# Altium schematic sheet MCU.SchDoc
size A4; DocumentNumber: 4; SheetNumber: 2; SheetTotal: 6
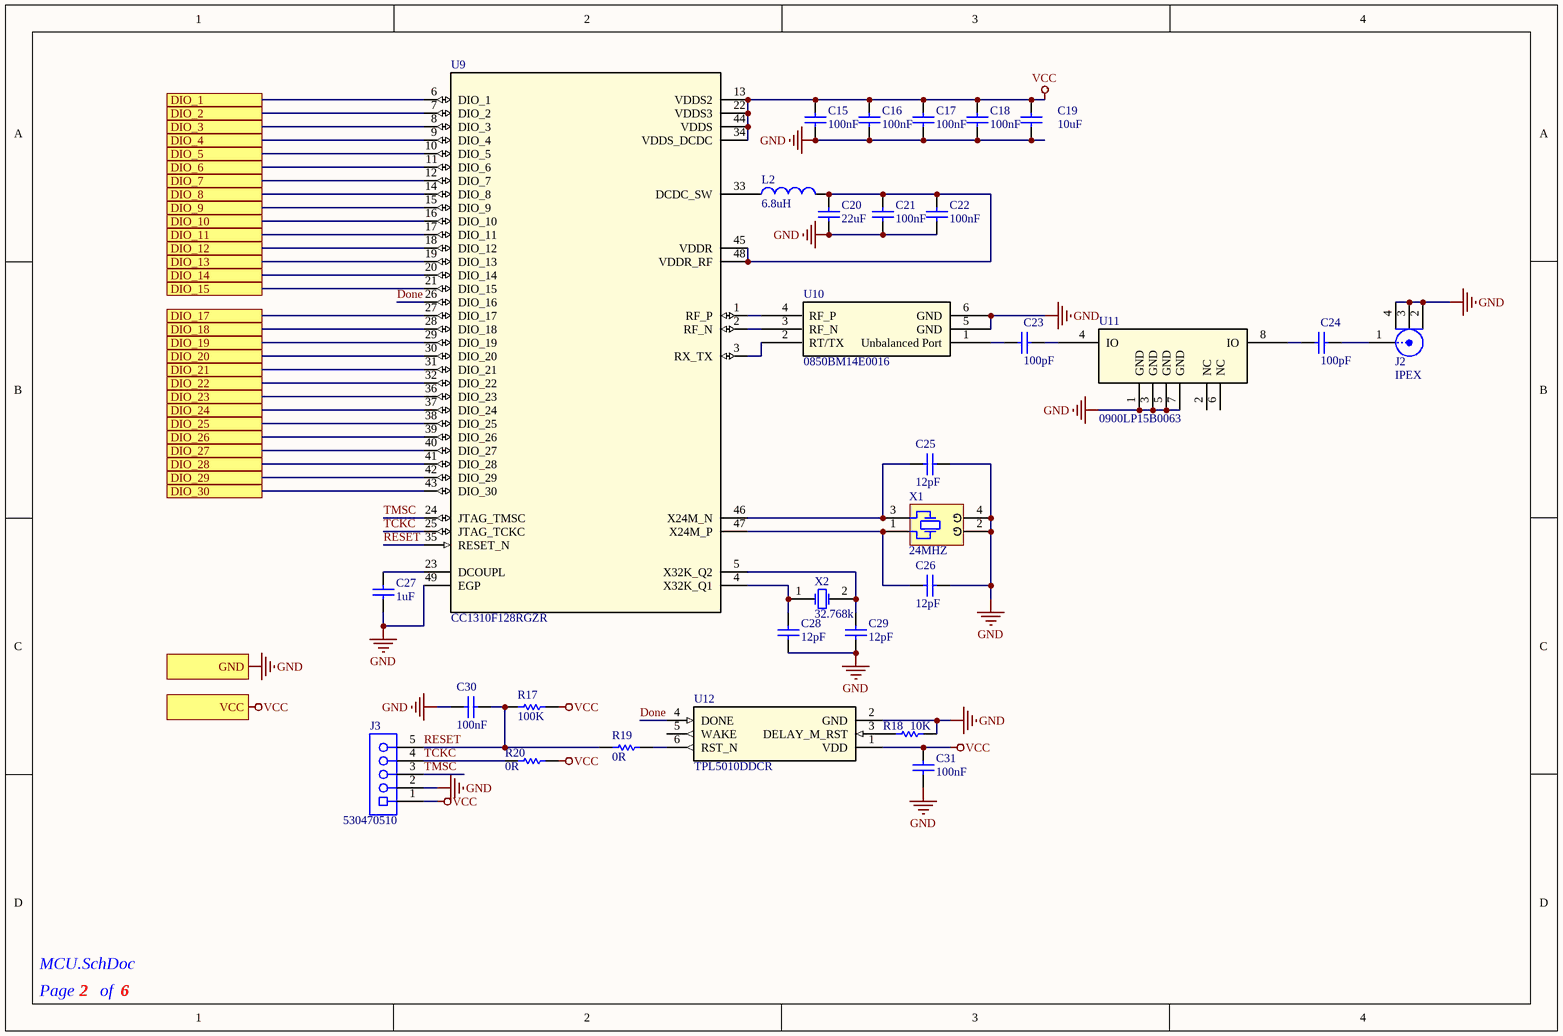
[diagram p0: MCU.SchDoc]

## Parts
C15  100nF  [R0603_C]
C16  100nF  [R0603_C]
C17  100nF  [R0603_C]
C18  100nF  [R0603_C]
C19  10uF  [R0805_C]
C20  22uF  [R0805_C]
C21  100nF  [R0603_C]
C22  100nF  [R0603_C]
C23  100pF  [R0402_C]
C24  100pF  [R0402_C]
C25  12pF  [R0402_C]
C26  12pF  [R0402_C]
C27  1uF  [R0603_C]
C28  12pF  [R0402_C]
C29  12pF  [R0402_C]
C30  100nF  [R0603_C]
C31  100nF  [R0603_C]
J2  IPEX  [molex-73412]
J3  530470510  [1.25mm_p5]
L2  6.8uH  [R0805_L]
R17  100K  [R0603_R]
R18  10K  [R0603_R]
R19  0R  [R0603_R]
R20  0R  [R0603_R]
U9  CC1310F128RGZR  [RGZ0048A]
U10  0850BM14E0016  [6P0603]
U11  0900LP15B0063  [8P0805]
U12  TPL5010DDCR  [DBV0006A_N]
X1  24MHZ  [SMD-3225]
X2  32.768k  [FC-135]

## Ports
DIO_1, DIO_2, DIO_3, DIO_4, DIO_5, DIO_6, DIO_7, DIO_8, DIO_9, DIO_10, DIO_11, DIO_12, DIO_13, DIO_14, DIO_15, DIO_17, DIO_18, DIO_19, DIO_20, DIO_21, DIO_22, DIO_23, DIO_24, DIO_25, DIO_26, DIO_27, DIO_28, DIO_29, DIO_30, GND, VCC

## Nets
GND: C15.1 C16.1 C17.1 C18.1 C19.1 C20.1 C21.1 C22.1 C25.1 C26.1 C27.1 C28.1 C29.1 C30.2 C31.1 J2.2 J2.3 J2.4 J3.2 R18.1 U9.49(EGP) U10.5(GND) U10.6(GND) U11.1(GND) U11.3(GND) U11.5(GND) U11.7(GND) U12.2(GND) X1.2(GND) X1.4(GND) ; port GND
VCC: C15.2 C16.2 C17.2 C18.2 C19.2 C31.2 J3.1 R17.2 R20.1 U9.13(VDDS2) U9.22(VDDS3) U9.34(VDDS_DCDC) U9.44(VDDS) U12.1(VDD) ; port VCC
DIO_1: U9.6(DIO_1) ; port DIO_1
DIO_2: U9.7(DIO_2) ; port DIO_2
DIO_3: U9.8(DIO_3) ; port DIO_3
DIO_4: U9.9(DIO_4) ; port DIO_4
DIO_5: U9.10(DIO_5) ; port DIO_5
DIO_6: U9.11(DIO_6) ; port DIO_6
DIO_7: U9.12(DIO_7) ; port DIO_7
DIO_8: U9.14(DIO_8) ; port DIO_8
DIO_9: U9.15(DIO_9) ; port DIO_9
DIO_10: U9.16(DIO_10) ; port DIO_10
DIO_11: U9.17(DIO_11) ; port DIO_11
DIO_12: U9.18(DIO_12) ; port DIO_12
DIO_13: U9.19(DIO_13) ; port DIO_13
DIO_14: U9.20(DIO_14) ; port DIO_14
DIO_15: U9.21(DIO_15) ; port DIO_15
DIO_17: U9.27(DIO_17) ; port DIO_17
DIO_18: U9.28(DIO_18) ; port DIO_18
DIO_19: U9.29(DIO_19) ; port DIO_19
DIO_20: U9.30(DIO_20) ; port DIO_20
DIO_21: U9.31(DIO_21) ; port DIO_21
DIO_22: U9.32(DIO_22) ; port DIO_22
DIO_23: U9.36(DIO_23) ; port DIO_23
DIO_24: U9.37(DIO_24) ; port DIO_24
DIO_25: U9.38(DIO_25) ; port DIO_25
DIO_26: U9.39(DIO_26) ; port DIO_26
DIO_27: U9.40(DIO_27) ; port DIO_27
DIO_28: U9.41(DIO_28) ; port DIO_28
DIO_29: U9.42(DIO_29) ; port DIO_29
DIO_30: U9.43(DIO_30) ; port DIO_30
Done: U9.26(DIO_16) U12.4(DONE)
RESET: C30.1 J3.5 R17.1 R19.2 U9.35(RESET_N)
TCKC: J3.4 R20.2 U9.25(JTAG_TCKC)
TMSC: J3.3 U9.24(JTAG_TMSC)
NetC20_2: C20.2 C21.2 C22.2 L2.2 U9.45(VDDR) U9.48(VDDR_RF)
NetC23_1: C23.1 U10.1(Unbalanced_Port)
NetC23_2: C23.2 U11.4(IO)
NetC24_1: C24.1 U11.8(IO)
NetC24_2: C24.2 J2.1
NetC25_2: C25.2 U9.46(X24M_N) X1.3
NetC26_2: C26.2 U9.47(X24M_P) X1.1
NetC27_2: C27.2 U9.23(DCOUPL)
NetC28_2: C28.2 U9.4(X32K_Q1) X2.1(OSC1)
NetC29_2: C29.2 U9.5(X32K_Q2) X2.2(OSC2)
NetL2_1: L2.1 U9.33(DCDC_SW)
NetR18_2: R18.2 U12.3(DELAY_M_RST)
NetR19_1: R19.1 U12.6(RST_N)
NetU9_1: U9.1(RF_P) U10.4(RF_P)
NetU9_2: U9.2(RF_N) U10.3(RF_N)
NetU9_3: U9.3(RX_TX) U10.2(RT/TX)

Not connected (* = marked no-connect by the designer): U11 2(NC) 6(NC); U12 5(WAKE)

## Notes on the sheet
- Page
- of
- (in symbol X1E000021012700) G

## Library data of the parts
C15-C18 C21 C22 C30 C31 = 100nF/0603/50V: 精度 ±10% / 容值 100nF / 额定电压 50V / 温漂系数（介质材料) X7R; 厂家: FH(风华); 型号: 0603B104K500NT; 封装: 0603; 类型: Capacitor; 订货编码: C30926
C19 = 10uF/0805/16V: 精度 ±10% / 容值 10uF / 额定电压 16V / 温漂系数（介质材料) X7R; 厂家: FH(风华); 型号: 0805B106K160NT; 封装: 0805; 类型: Capacitor; 订货编码: C92341
C20 = 22uF/0805/16V: 精度 ±20% / 容值 22uF / 额定电压 16V / 温漂系数（介质材料) X5R; 厂家: FH(风华); 型号: 0805X226M160NT; 封装: 0805; 类型: Capacitor; 订货编码: C129302
C23 C24 = 100pF/0402/50V: 精度 ±5% / 容值 100pF / 额定电压 50V / 温漂系数（介质材料) C0G; 厂家: FH(风华); 型号: 0402CG101J500NT; 封装: 0402; 类型: Capacitor; 订货编码: C1546
C25 C26 C28 C29 = 12pF/0402/50V: 精度 ±1% / 容值 12pF / 额定电压 50V / 温漂系数（介质材料) C0G; 厂家: FH(风华); 型号: 0402CG120F500NT; 封装: 0402; 类型: Capacitor; 订货编码: C182477
C27 = 1uF/0603/50V: 精度 ±10% / 容值 1uF / 额定电压 50V / 温漂系数（介质材料) X7R; 厂家: FH(风华); 型号: 0603B105K500NT; 封装: 0603; 类型: Capacitor; 订货编码: C90540
J2 = 73412-0110: RF同轴连接器（天线座）; 厂家: MOLEX; 型号: 734120110; 封装: SMD; 类型: IPEX插座; 订货编码: C434806; System: Connector
J3 = Molex-530470510: MX1.25 直插 镀锡 5P 针座; 厂家: MOLEX; 封装: 1.25mm 5p; 类型: 连接器; 订货编码: C471412; System: Connector; 型号: 530470510
L2 = 6.8uH/0805: 精度 ±10% / 电感值 6.8uH / 直流电阻（内阻） 250mΩ / 额定电流 250mA; 厂家: FH(风华); 型号: CMP201209XD6R8KT; 封装: 0805; 类型: Inductor; 订货编码: C139247
R17 = 100K/0603: 精度 ±1% / 阻值 100kΩ / 温度系数 ±100ppm/℃ / 功率 0.1W; 厂家: FH(风华); 型号: RS-03K1003FT; 类型: Resistor; 订货编码: C115320; 封装: 0603
R18 = 10K/0603: 精度 ±1% / 温度系数 ±100ppm/℃ / 阻值 10kΩ / 功率 0.1W; 厂家: FH(风华); 型号: RS-03K1002FT; 类型: Resistor; 订货编码: C115324; 封装: 0603
R19 R20 = 0R/0603: 精度 ±1% / 阻值 0Ω / 功率 0.1W; 厂家: FH(风华); 型号: RS-03000FT; 类型: Resistor; 订货编码: C136582; 封装: 0603
U9 = CC1310F128RGZR: RF-MCU; 厂家: TI(德州仪器); 封装: VQFN-48; 类型: MCU; 订货编码: C84353; 型号: CC1310F128RGZR
U10 = 0850BM14E0016: 770 - 860 860 - 928MHz / -40°C to +85°C / Pmax 2W; 厂家: Johanson Technology; 类型: Balun; 型号: 0850BM14E0016; 封装: 6P0603; 订货编码: -
U11 = 0900LP15B0063: 863 - 960MHz / -40 to +85°C / 3Fo Attenuation (2589-2784MHz) 50dB / 2Fo Attenuation (1726-1856MHz) 59dB /; 厂家: Johanson Technology; 类型: 低通; 型号: 0900LP15B0063; 封装: 8P0805
U12 = TPL5010DDCR: 看门狗; 厂家: TI(德州仪器); 封装: SOT23-Thin-6; 订货编码: C473912; 型号: TPL5010DDCR; 类型: 看门狗
X1 = X1E000021012700: 等效串联电阻（ESR） 40Ω / 无源贴片晶振 / 主频 24MHz / 频率公差 ±10ppm / 负载电容值 9pF / 工作温度 -40℃~85℃; 厂家: EPSON(爱普生); 型号: X1A000061002100; 类型: 晶振; 订货编码: C89577; 封装: SMD-3225
X2 = FC-135 32.768KHz ±20ppm 12.5pF: 等效串联电阻（ESR） 70kΩ / 晶振类型 无源贴片晶振 / 主频 32.768KHz / 频率公差 ±20ppm / 负载电容值 12.5pF / 工作温度 -40℃~85℃; 厂家: EPSON(爱普生); 型号: Q13FC1350000400; 封装: SMD-3215_2P; 类型: 晶振; 订货编码: C32346